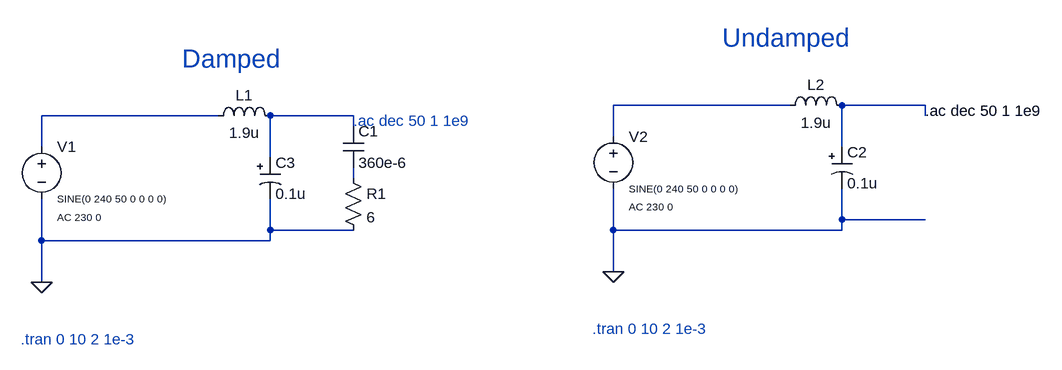
[diagram p0: schematic LCout.asc]
LCout.asc, the LTspice schematic file:
Version 4
SHEET 1 1408 680
WIRE 1008 32 736 32
WIRE 1216 32 1088 32
WIRE 128 48 -144 48
WIRE 336 48 208 48
WIRE 1216 48 1216 32
WIRE 336 64 336 48
WIRE 736 80 736 32
WIRE -144 96 -144 48
WIRE 1088 96 1088 32
WIRE 208 112 208 48
WIRE 336 144 336 128
WIRE 1088 208 1088 160
WIRE 1216 208 1088 208
WIRE 208 224 208 176
WIRE 336 224 208 224
WIRE 736 224 736 160
WIRE 1088 224 1088 208
WIRE 1088 224 736 224
WIRE -144 240 -144 176
WIRE 208 240 208 224
WIRE 208 240 -144 240
WIRE 736 288 736 224
WIRE -144 304 -144 240
FLAG -144 304 0
FLAG 736 288 0
SYMBOL voltage -144 80 R0
WINDOW 3 24 96 Left 1
WINDOW 123 24 124 Left 1
WINDOW 39 0 0 Left 0
SYMATTR Value SINE(0 240 50 0 0 0 0)
SYMATTR Value2 AC 230 0
SYMATTR InstName V1
SYMBOL polcap 192 112 R0
WINDOW 3 24 56 Left 2
SYMATTR Value 0.1u
SYMATTR InstName C3
SYMATTR Description Capacitor
SYMATTR Type cap
SYMATTR SpiceLine V=0 Irms=0 Rser=0 Lser=0
SYMBOL ind 112 64 R270
WINDOW 0 32 56 VTop 2
WINDOW 3 5 56 VBottom 2
SYMATTR InstName L1
SYMATTR Value 1.9u
SYMBOL res 320 128 R0
SYMATTR InstName R1
SYMATTR Value 6
SYMBOL cap 320 64 R0
SYMATTR InstName C1
SYMATTR Value 360e-6
SYMBOL voltage 736 64 R0
WINDOW 3 24 96 Left 1
WINDOW 123 24 124 Left 1
WINDOW 39 0 0 Left 0
SYMATTR Value SINE(0 240 50 0 0 0 0)
SYMATTR Value2 AC 230 0
SYMATTR InstName V2
SYMBOL polcap 1072 96 R0
WINDOW 3 24 56 Left 2
SYMATTR Value 0.1u
SYMATTR InstName C2
SYMATTR Description Capacitor
SYMATTR Type cap
SYMATTR SpiceLine V=0 Irms=0 Rser=0 Lser=0
SYMBOL ind 992 48 R270
WINDOW 0 32 56 VTop 2
WINDOW 3 5 56 VBottom 2
SYMATTR InstName L2
SYMATTR Value 1.9u
TEXT -176 392 Left 2 ;.tran 0 10 2 1e-3
TEXT 336 56 Left 2 ;.ac dec 50 1 1e9
TEXT 704 376 Left 2 ;.tran 0 10 2 1e-3
TEXT 1216 40 Left 2 !.ac dec 50 1 1e9
TEXT 72 -40 Left 4 ;Damped
TEXT 904 -72 Left 4 ;Undamped

The netlist it stands for:
* LCout.asc
V1 N003 0 SINE(0 240 50 0 0 0 0) AC 230 0
C3 N004 0 0.1u V=0 Irms=0 Rser=0 Lser=0
L1 N003 N004 1.9u
R1 N005 0 6
C1 N004 N005 360e-6
V2 N001 0 SINE(0 240 50 0 0 0 0) AC 230 0
C2 N002 0 0.1u V=0 Irms=0 Rser=0 Lser=0
L2 N001 N002 1.9u
* .tran 0 10 2 1e-3
* .ac dec 50 1 1e9
* .tran 0 10 2 1e-3
.ac dec 50 1 1e9
* Damped
* Undamped
.backanno
.end